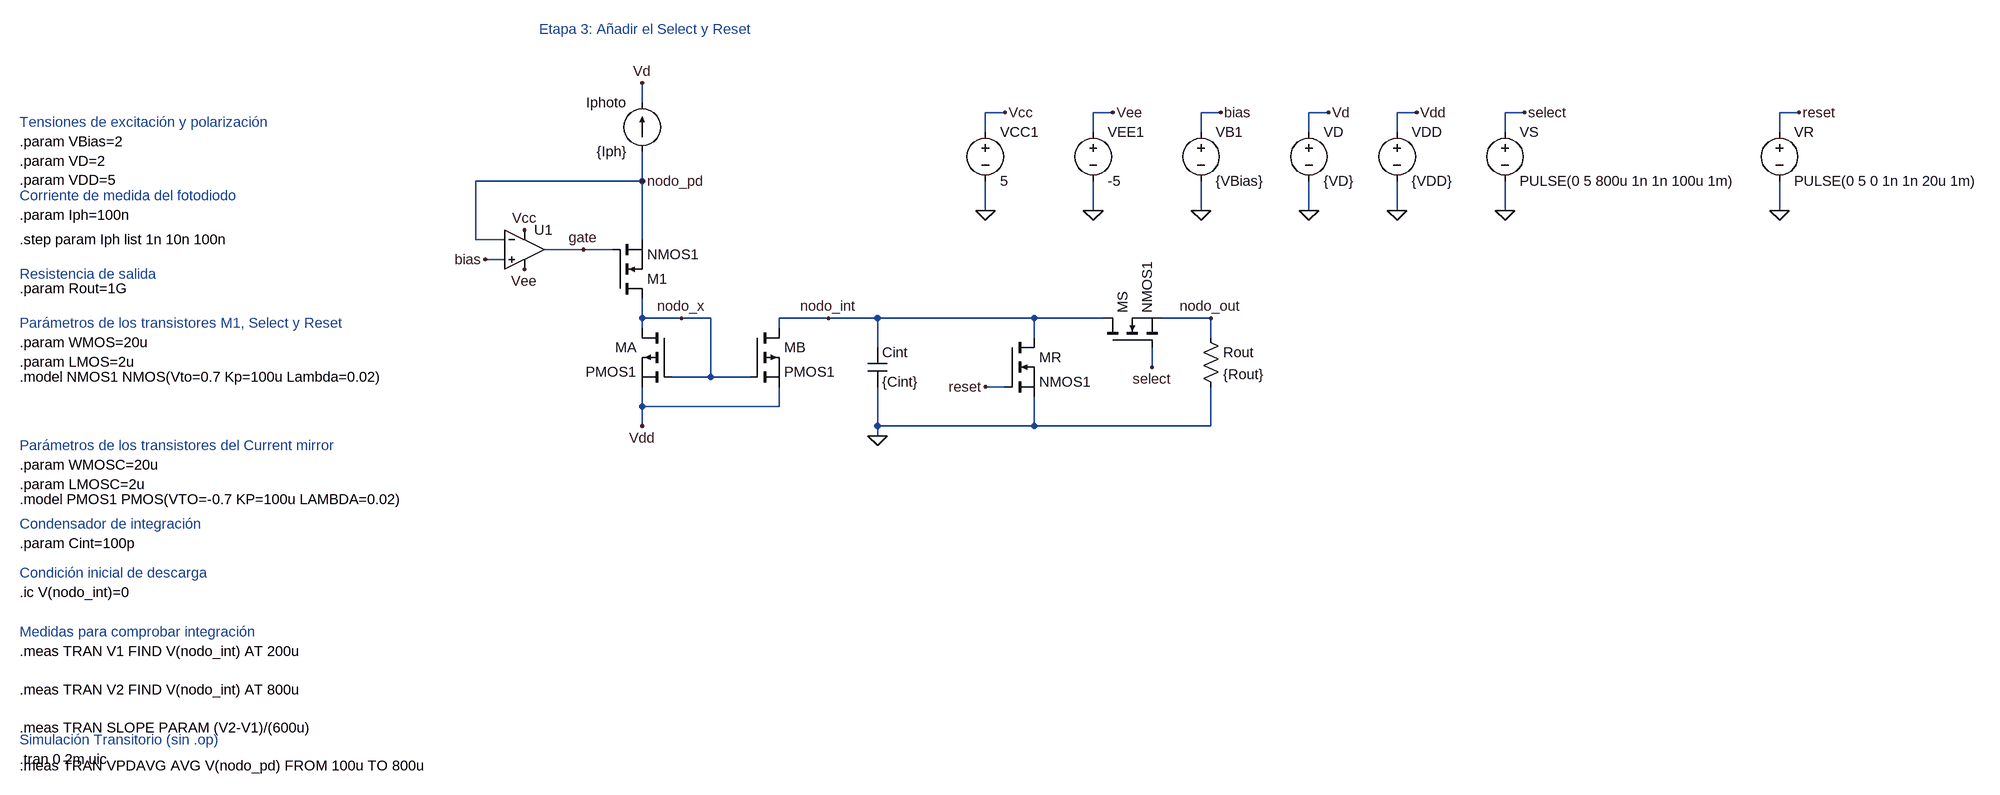
[diagram p0: schematic BGMI_Definitivo.asc]
BGMI_Definitivo.asc, the LTspice schematic file:
Version 4.1
SHEET 1 2268 784
WIRE 64 -384 64 -416
WIRE 656 -368 624 -368
WIRE 832 -368 800 -368
WIRE 1008 -368 976 -368
WIRE 1184 -368 1152 -368
WIRE 1328 -368 1296 -368
WIRE 1504 -368 1472 -368
WIRE 1952 -368 1920 -368
WIRE 624 -336 624 -368
WIRE 800 -336 800 -368
WIRE 976 -336 976 -368
WIRE 1152 -336 1152 -368
WIRE 1296 -336 1296 -368
WIRE 1472 -336 1472 -368
WIRE 1920 -336 1920 -368
WIRE 64 -256 64 -304
WIRE 64 -256 -208 -256
WIRE 624 -208 624 -256
WIRE 800 -208 800 -256
WIRE 976 -208 976 -256
WIRE 1152 -208 1152 -256
WIRE 1296 -208 1296 -256
WIRE 1472 -208 1472 -256
WIRE 1920 -208 1920 -256
WIRE -208 -160 -208 -256
WIRE -160 -160 -208 -160
WIRE 64 -160 64 -256
WIRE -32 -144 -96 -144
WIRE 16 -144 -32 -144
WIRE -160 -128 -192 -128
WIRE 64 -32 64 -64
WIRE 128 -32 64 -32
WIRE 176 -32 128 -32
WIRE 368 -32 288 -32
WIRE 448 -32 368 -32
WIRE 704 -32 448 -32
WIRE 816 -32 704 -32
WIRE 992 -32 912 -32
WIRE 64 -16 64 -32
WIRE 288 -16 288 -32
WIRE 704 0 704 -32
WIRE 992 0 992 -32
WIRE 448 16 448 -32
WIRE 896 48 896 16
WIRE 176 64 176 -32
WIRE 176 64 112 64
WIRE 240 64 176 64
WIRE 656 80 624 80
WIRE 64 112 64 80
WIRE 288 112 288 80
WIRE 288 112 64 112
WIRE 64 144 64 112
WIRE 448 144 448 80
WIRE 704 144 704 96
WIRE 704 144 448 144
WIRE 992 144 992 80
WIRE 992 144 704 144
WIRE 448 160 448 144
FLAG 1152 -208 0
FLAG 64 -256 nodo_pd
FLAG -128 -176 Vcc
FLAG -128 -112 Vee
FLAG -192 -128 bias
FLAG 1008 -368 bias
FLAG 624 -208 0
FLAG 800 -208 0
FLAG 656 -368 Vcc
FLAG 832 -368 Vee
FLAG 976 -208 0
FLAG 1184 -368 Vd
FLAG 64 -416 Vd
FLAG 128 -32 nodo_x
FLAG 448 160 0
FLAG 368 -32 nodo_int
FLAG 1296 -208 0
FLAG 1328 -368 Vdd
FLAG 64 144 Vdd
FLAG -32 -144 gate
FLAG 1472 -208 0
FLAG 1504 -368 select
FLAG 896 48 select
FLAG 992 -32 nodo_out
FLAG 1920 -208 0
FLAG 1952 -368 reset
FLAG 624 80 reset
SYMBOL current 64 -304 R180
WINDOW 0 24 80 Left 2
WINDOW 3 24 0 Left 2
WINDOW 123 0 0 Left 0
WINDOW 39 0 0 Left 0
SYMATTR InstName Iphoto
SYMATTR Value {Iph}
SYMBOL voltage 1152 -352 R0
SYMATTR InstName VD
SYMATTR Value {VD}
SYMBOL OpAmps\\UniversalOpAmp2 -128 -144 R0
SYMATTR InstName U1
SYMBOL voltage 976 -352 R0
SYMATTR InstName VB1
SYMATTR Value {VBias}
SYMBOL voltage 624 -352 R0
SYMATTR InstName VCC1
SYMATTR Value 5
SYMBOL voltage 800 -352 R0
SYMATTR InstName VEE1
SYMATTR Value -5
SYMBOL nmos 16 -64 M180
SYMATTR InstName M1
SYMATTR Value NMOS1
SYMATTR SpiceLine L={LMOS} W={WMOS}
SYMBOL pmos 240 -16 R0
SYMATTR InstName MB
SYMATTR Value PMOS1
SYMATTR SpiceLine L={LMOSC} W={WMOSC}
SYMBOL pmos 112 -16 M0
SYMATTR InstName MA
SYMATTR Value PMOS1
SYMATTR SpiceLine L={LMOSC} W={WMOSC}
SYMBOL voltage 1296 -352 R0
SYMATTR InstName VDD
SYMATTR Value {VDD}
SYMBOL cap 432 16 R0
SYMATTR InstName Cint
SYMATTR Value {Cint}
SYMBOL voltage 1472 -352 R0
SYMATTR InstName VS
SYMATTR Value PULSE(0 5 800u 1n 1n 100u 1m)
SYMBOL res 976 -16 R0
SYMATTR InstName Rout
SYMATTR Value {Rout}
SYMBOL nmos 656 0 R0
SYMATTR InstName MR
SYMATTR Value NMOS1
SYMATTR SpiceLine L={LMOS} W={WMOS}
SYMBOL voltage 1920 -352 R0
SYMATTR InstName VR
SYMATTR Value PULSE(0 5 0 1n 1n 20u 1m)
SYMBOL nmos 816 16 R270
SYMATTR InstName MS
SYMATTR Value NMOS1
SYMATTR SpiceLine L={LMOS} W={WMOS}
TEXT -104 -504 Left 2 ;Etapa 3: Añadir el Select y Reset
TEXT -952 -232 Left 2 ;Corriente de medida del fotodiodo
TEXT -952 -200 Left 2 !.param Iph=100n
TEXT -952 -160 Left 2 !.step param Iph list 1n 10n 100n
TEXT -952 -352 Left 2 ;Tensiones de excitación y polarización
TEXT -952 -320 Left 2 !.param VBias=2\n.param VD=2\n.param VDD=5
TEXT -952 264 Left 2 !.model PMOS1 PMOS(VTO=-0.7 KP=100u LAMBDA=0.02)
TEXT -952 8 Left 2 !.param WMOS=20u\n.param LMOS=2u
TEXT -952 -24 Left 2 ;Parámetros de los transistores M1, Select y Reset
TEXT -952 64 Left 2 !.model NMOS1 NMOS(Vto=0.7 Kp=100u Lambda=0.02)
TEXT -952 -104 Left 2 ;Resistencia de salida
TEXT -952 -80 Left 2 !.param Rout=1G
TEXT -952 304 Left 2 ;Condensador de integración
TEXT -952 336 Left 2 !.param Cint=100p
TEXT -952 384 Left 2 ;Condición inicial de descarga
TEXT -952 416 Left 2 !.ic V(nodo_int)=0
TEXT -952 688 Left 2 !.tran 0 2m uic
TEXT -952 656 Left 2 ;Simulación Transitorio (sin .op)
TEXT -952 480 Left 2 ;Medidas para comprobar integración
TEXT -952 512 Left 2 !.meas TRAN V1 FIND V(nodo_int) AT 200u\n\n.meas TRAN V2 FIND V(nodo_int) AT 800u\n\n.meas TRAN SLOPE PARAM (V2-V1)/(600u)\n\n.meas TRAN VPDAVG AVG V(nodo_pd) FROM 100u TO 800u
TEXT -952 176 Left 2 ;Parámetros de los transistores del Current mirror
TEXT -952 208 Left 2 !.param WMOSC=20u\n.param LMOSC=2u

The netlist it stands for:
* BGMI_Definitivo.asc
Iphoto nodo_pd Vd {Iph}
VD Vd 0 {VD}
X§U1 bias nodo_pd Vcc Vee gate level2 Avol=1Meg GBW=10Meg Slew=10Meg Ilimit=25m Rail=0 Vos=0 En=0 Enk=0 In=0 Ink=0 Rin=500Meg  ; pins In+ In- V+ V- OUT
VB1 bias 0 {VBias}
VCC1 Vcc 0 5
VEE1 Vee 0 -5
M1 nodo_x gate nodo_pd nodo_pd NMOS1 L={LMOS} W={WMOS}
MB nodo_int nodo_x Vdd Vdd PMOS1 L={LMOSC} W={WMOSC}
MA nodo_x nodo_x Vdd Vdd PMOS1 L={LMOSC} W={WMOSC}
VDD Vdd 0 {VDD}
Cint nodo_int 0 {Cint}
VS select 0 PULSE(0 5 800u 1n 1n 100u 1m)
Rout nodo_out 0 {Rout}
MR nodo_int reset 0 0 NMOS1 L={LMOS} W={WMOS}
VR reset 0 PULSE(0 5 0 1n 1n 20u 1m)
MS nodo_int select nodo_out nodo_out NMOS1 L={LMOS} W={WMOS}
.model NMOS NMOS
.model PMOS PMOS
.lib standard.mos
* Etapa 3: Añadir el Select y Reset
* Corriente de medida del fotodiodo
.param Iph=100n
.step param Iph list 1n 10n 100n
* Tensiones de excitación y polarización
.param VBias=2
.param VD=2
.param VDD=5
.model PMOS1 PMOS(VTO=-0.7 KP=100u LAMBDA=0.02)
.param WMOS=20u
.param LMOS=2u
* Parámetros de los transistores M1, Select y Reset
.model NMOS1 NMOS(Vto=0.7 Kp=100u Lambda=0.02)
* Resistencia de salida
.param Rout=1G
* Condensador de integración
.param Cint=100p
* Condición inicial de descarga
.ic V(nodo_int)=0
.tran 0 2m uic
* Simulación Transitorio (sin .op)
* Medidas para comprobar integración
.meas TRAN V1 FIND V(nodo_int) AT 200u
.meas TRAN V2 FIND V(nodo_int) AT 800u
.meas TRAN SLOPE PARAM (V2-V1)/(600u)
.meas TRAN VPDAVG AVG V(nodo_pd) FROM 100u TO 800u
* Parámetros de los transistores del Current mirror
.param WMOSC=20u
.param LMOSC=2u
.lib UniversalOpAmp2.lib
.backanno
.end

* Results of the author's LTspice run, read from the files saved beside the schematic
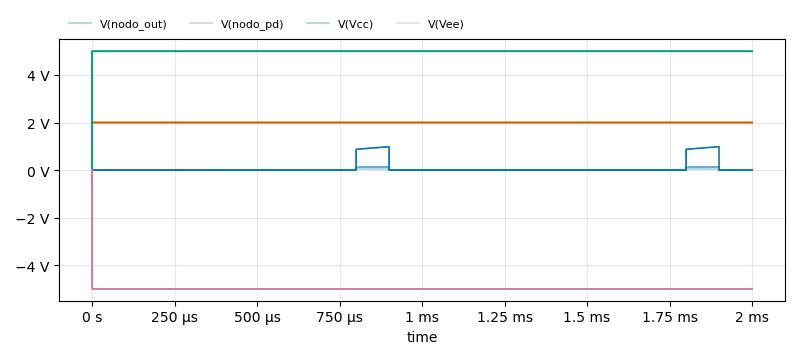
[diagram p1: Transient Analysis of BGMI_Definitivo.asc, plotted from the saved traces]
* Transient Analysis, 3 runs:
*   V(nodo_out) [iph=1e-09]: min 0 V, max 47.74 mV, average 4.553 mV, rms 14.25 mV, last 114.8 µV
*   V(nodo_out) [iph=1e-08]: min 0 V, max 133.4 mV, average 12.72 mV, rms 39.84 mV, last 306.5 µV
*   V(nodo_out) [iph=1e-07]: min 0 V, max 982.8 mV, average 93.68 mV, rms 293.6 mV, last 2.193 mV
*   V(nodo_pd) [iph=1e-09]: min -457.2 mV, max 2.022 V, average 2 V, rms 2 V, last 2 V
*   V(nodo_pd) [iph=1e-08]: min -460.3 mV, max 2.018 V, average 2 V, rms 2 V, last 2 V
*   V(nodo_pd) [iph=1e-07]: min -713.9 mV, max 2.015 V, average 2 V, rms 2 V, last 2 V
*   V(Vcc) [iph=1e-09]: min 0 V, max 5 V, average 5 V, rms 5 V, last 5 V
*   V(Vcc) [iph=1e-08]: min 0 V, max 5 V, average 5 V, rms 5 V, last 5 V
*   V(Vcc) [iph=1e-07]: min 0 V, max 5 V, average 5 V, rms 5 V, last 5 V
*   V(Vee) [iph=1e-09]: min -5 V, max 0 V, average -5 V, rms 5 V, last -5 V
*   V(Vee) [iph=1e-08]: min -5 V, max 0 V, average -5 V, rms 5 V, last -5 V
*   V(Vee) [iph=1e-07]: min -5 V, max 0 V, average -5 V, rms 5 V, last -5 V
* From the log:
*   Measurement: v1
*     step  V(nodo_int)   at
*        1  0.00977820648647  0.0002
*        2  0.0273460278974  0.0002
*        3  0.202683834002  0.0002
*   Measurement: v2
*     step  V(nodo_int)   at
*        1  0.0423549450934  0.0008
*        2  0.118388168514  0.0008
*        3  0.872821927071  0.0008
*   Measurement: slope
*     step  (V2-V1)/(600u)
*        1  54.2945643449
*        2  151.736901027
*        3  1116.89682178
*   Measurement: vpdavg
*     step  AVG(V(nodo_pd) )  FROM  TO
*        1  1.99999731775  0.0001  0.0008
*        2  1.99999725821  0.0001  0.0008
*        3  1.99999726415  0.0001  0.0008